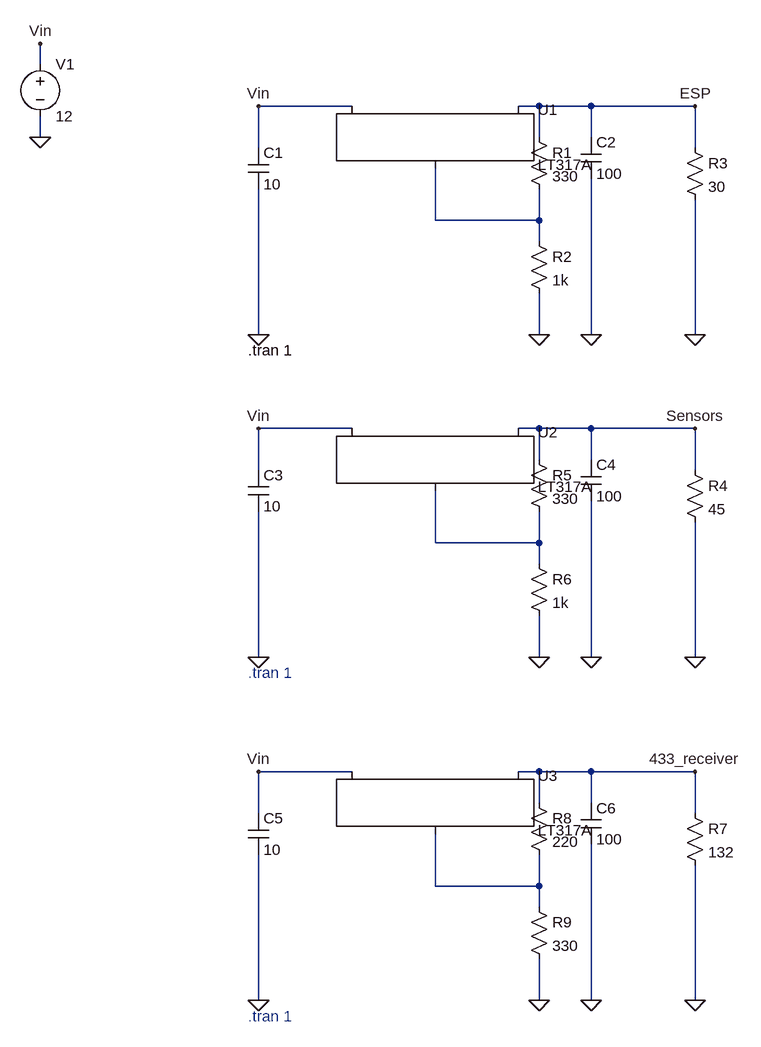
[diagram p0: schematic LM317_5_5_4_4.asc]
LM317_5_5_4_4.asc, the LTspice schematic file:
Version 4
SHEET 1 880 1560
WIRE -400 80 -400 48
WIRE 80 144 -64 144
WIRE 368 144 336 144
WIRE 448 144 368 144
WIRE 608 144 448 144
WIRE -400 192 -400 160
WIRE 368 192 368 144
WIRE 448 192 448 144
WIRE -64 208 -64 144
WIRE 608 208 608 144
WIRE 208 320 208 240
WIRE 368 320 368 272
WIRE 368 320 208 320
WIRE 368 352 368 320
WIRE -64 496 -64 272
WIRE 368 496 368 432
WIRE 448 496 448 256
WIRE 608 496 608 288
WIRE 80 640 -64 640
WIRE 368 640 336 640
WIRE 448 640 368 640
WIRE 608 640 448 640
WIRE 368 688 368 640
WIRE 448 688 448 640
WIRE -64 704 -64 640
WIRE 608 704 608 640
WIRE 208 816 208 736
WIRE 368 816 368 768
WIRE 368 816 208 816
WIRE 368 848 368 816
WIRE -64 992 -64 768
WIRE 368 992 368 928
WIRE 448 992 448 752
WIRE 608 992 608 784
WIRE 80 1168 -64 1168
WIRE 368 1168 336 1168
WIRE 448 1168 368 1168
WIRE 608 1168 448 1168
WIRE 368 1216 368 1168
WIRE 448 1216 448 1168
WIRE -64 1232 -64 1168
WIRE 608 1232 608 1168
WIRE 208 1344 208 1264
WIRE 368 1344 368 1296
WIRE 368 1344 208 1344
WIRE 368 1376 368 1344
WIRE -64 1520 -64 1296
WIRE 368 1520 368 1456
WIRE 448 1520 448 1280
WIRE 608 1520 608 1312
FLAG -64 496 0
FLAG 448 496 0
FLAG 608 496 0
FLAG -400 192 0
FLAG -64 144 Vin
FLAG 608 144 ESP
FLAG -400 48 Vin
FLAG 368 496 0
FLAG -64 992 0
FLAG 448 992 0
FLAG 608 992 0
FLAG -64 640 Vin
FLAG 608 640 Sensors
FLAG 368 992 0
FLAG -64 1520 0
FLAG 448 1520 0
FLAG 608 1520 0
FLAG -64 1168 Vin
FLAG 608 1168 433_receiver
FLAG 368 1520 0
SYMBOL PowerProducts\\LT317A 208 144 R0
SYMATTR InstName U1
SYMBOL cap -80 208 R0
SYMATTR InstName C1
SYMATTR Value 10
SYMBOL cap 432 192 R0
SYMATTR InstName C2
SYMATTR Value 100
SYMBOL res 592 192 R0
SYMATTR InstName R3
SYMATTR Value 30
SYMBOL voltage -400 64 R0
WINDOW 123 0 0 Left 0
WINDOW 39 0 0 Left 0
SYMATTR InstName V1
SYMATTR Value 12
SYMBOL res 352 176 R0
SYMATTR InstName R1
SYMATTR Value 330
SYMBOL res 352 336 R0
SYMATTR InstName R2
SYMATTR Value 1k
SYMBOL PowerProducts\\LT317A 208 640 R0
SYMATTR InstName U2
SYMBOL cap -80 704 R0
SYMATTR InstName C3
SYMATTR Value 10
SYMBOL cap 432 688 R0
SYMATTR InstName C4
SYMATTR Value 100
SYMBOL res 592 688 R0
SYMATTR InstName R4
SYMATTR Value 45
SYMBOL res 352 672 R0
SYMATTR InstName R5
SYMATTR Value 330
SYMBOL res 352 832 R0
SYMATTR InstName R6
SYMATTR Value 1k
SYMBOL PowerProducts\\LT317A 208 1168 R0
SYMATTR InstName U3
SYMBOL cap -80 1232 R0
SYMATTR InstName C5
SYMATTR Value 10
SYMBOL cap 432 1216 R0
SYMATTR InstName C6
SYMATTR Value 100
SYMBOL res 592 1216 R0
SYMATTR InstName R7
SYMATTR Value 132
SYMBOL res 352 1200 R0
SYMATTR InstName R8
SYMATTR Value 220
SYMBOL res 352 1360 R0
SYMATTR InstName R9
SYMATTR Value 330
TEXT -80 520 Left 2 !.tran 1
TEXT -80 1016 Left 2 ;.tran 1
TEXT -80 1544 Left 2 ;.tran 1

The netlist it stands for:
* LM317_5_5_4_4.asc
XU1 N001 ESP Vin LT317A
C1 Vin 0 10
C2 ESP 0 100
R3 ESP 0 30
V1 Vin 0 12
R1 ESP N001 330
R2 N001 0 1k
XU2 N002 Sensors Vin LT317A
C3 Vin 0 10
C4 Sensors 0 100
R4 Sensors 0 45
R5 Sensors N002 330
R6 N002 0 1k
XU3 N003 433_receiver Vin LT317A
C5 Vin 0 10
C6 433_receiver 0 100
R7 433_receiver 0 132
R8 433_receiver N003 220
R9 N003 0 330
.tran 1
* .tran 1
* .tran 1
.lib LTC.lib
.backanno
.end